# EAGLE design sensorCO2 (EAGLE 6.6.0)
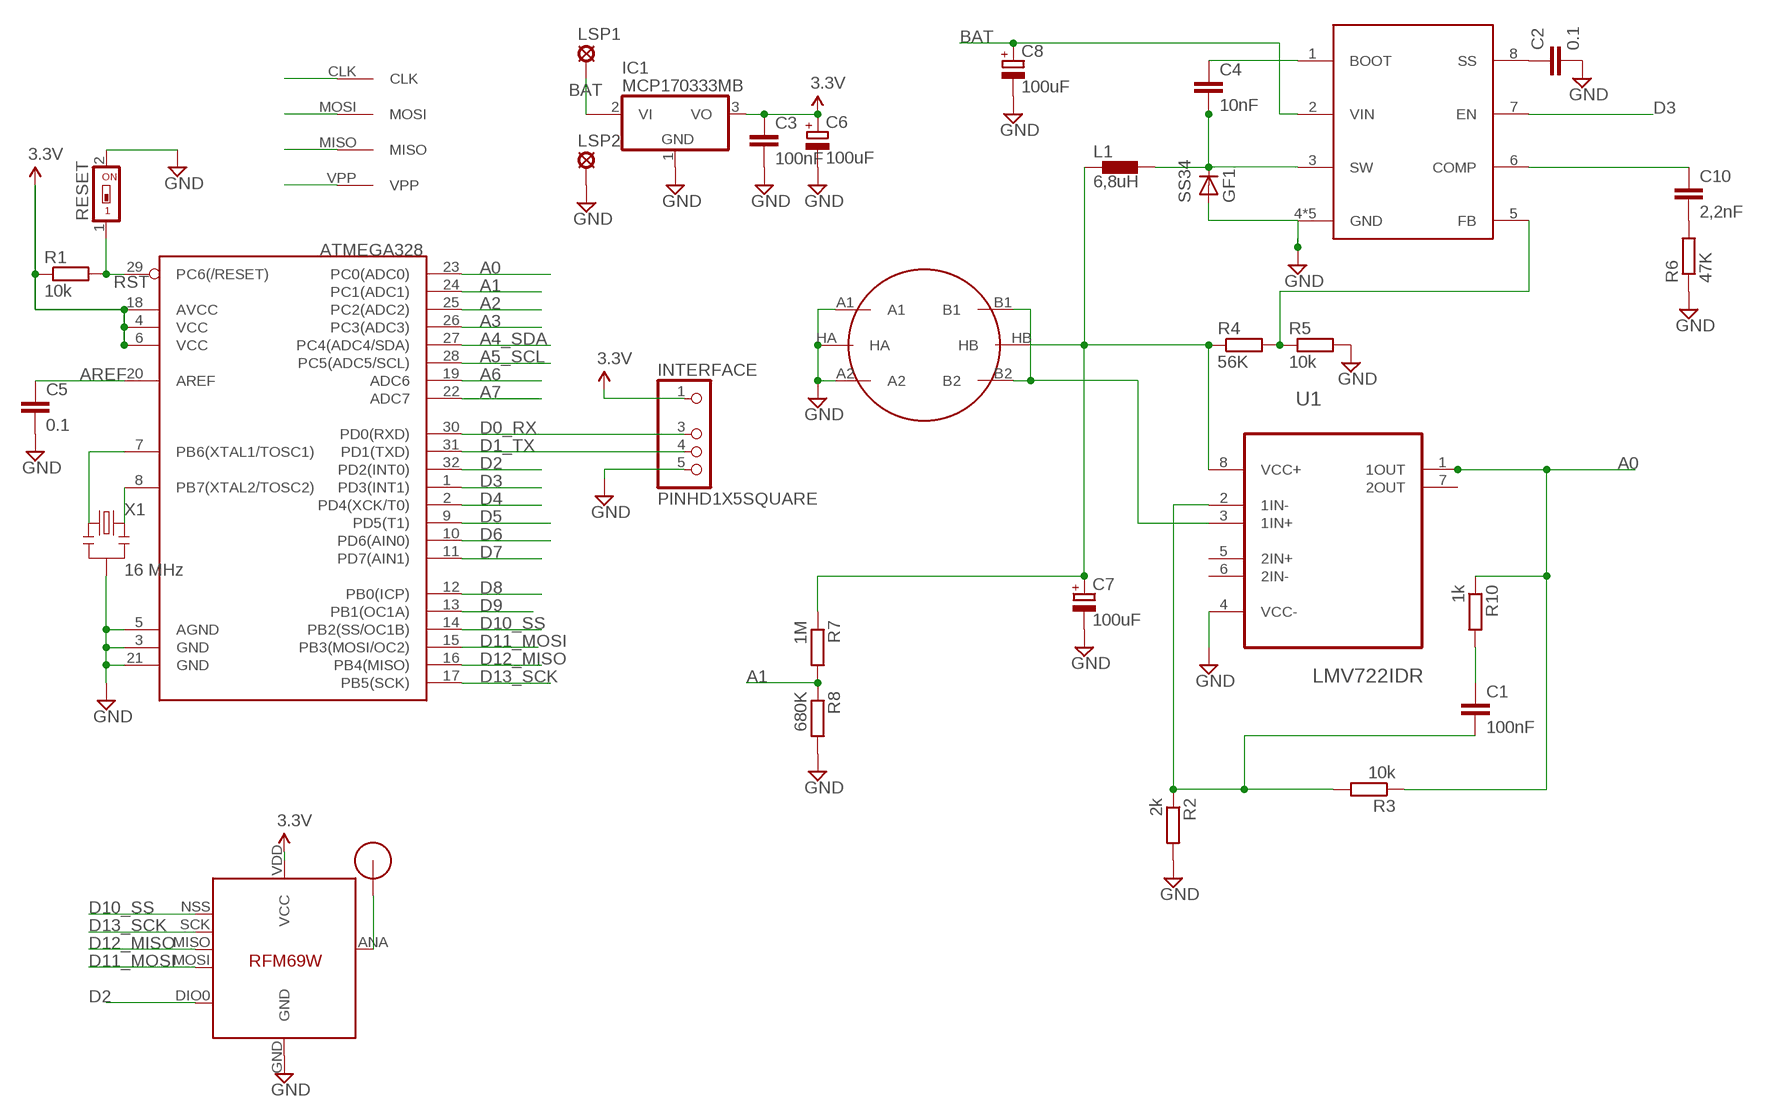
[diagram p0: schematic, sheet 1]

## Parts
ATMEGA328  ATMega-328  ATMEGA168/328TQFP32  [TQFP32-08]
C1  100nF  C-EUC2012  [C2012]
C2  0.1  C-EUC2012  [C2012]
C3  100nF  C-EUC2012  [C2012]
C4  10nF  C-EUC2012  [C2012]
C5  0.1  C-EUC2012  [C2012]
C6  100uF  CPOL-EUSMCB  [SMC_B]
C7  100uF  CPOL-EUSMCB  [SMC_B]
C8  100uF  CPOL-EUSMCB  [SMC_B]
C10  2,2nF  C-EUC2012  [C2012]
IC1  MCP170333MB  [SOT89]
IC4  RFM69  [RFM69W-MINPADS]
INTERFACE  PINHD1X5SQUARE  [PINHD1X05-SQUARE]
L1  6,8uH  DR1030  [DR1030]
LSP1  LSP11  [LSP11]
LSP2  LSP11  [LSP11]
R1  10k  R-EU_R2012  [R2012]
R2  2k  R-EU_R2012  [R2012]
R3  10k  R-EU_R2012  [R2012]
R4  56K  R-EU_R2012  [R2012]
R5  10k  R-EU_R2012  [R2012]
R6  47K  R-EU_R2012  [R2012]
R7  1M  R-EU_R2012  [R2012]
R8  680K  R-EU_R2012  [R2012]
R10  1k  R-EU_R2012  [R2012]
RESET  SWS001  [SMS-001]
SS34  GF1  [SMA-DO214AC]
U1  LMV722IDR  [SOIC127P600X175-8N]
U$1  RFM12B_ANTENNA  [RFM12B-ANTENNA]
U$2  AVRHEADERDIP  [AVRHEADER]
U$3  RT8272  [RT8272]
U$4  METHANE_SENSOR  [MQ-3]
X1  16 MHz  RESONATORSMD  [RESONATOR-SMD]

## Nets
6V: C7.+ L1.1 R4.1 R7.1 U1.8(VCC+) U$4.HB
A0: ATMEGA328.23(PC0(ADC0)) R3.1 R10.1 U1.1(1OUT)
A1: ATMEGA328.24(PC1(ADC1)) R7.2 R8.1
A2: ATMEGA328.25(PC2(ADC2))
A3: ATMEGA328.26(PC3(ADC3))
A4_SDA: ATMEGA328.27(PC4(ADC4/SDA))
A5_SCL: ATMEGA328.28(PC5(ADC5/SCL))
A6: ATMEGA328.19(ADC6)
A7: ATMEGA328.22(ADC7)
AREF: ATMEGA328.20(AREF) C5.1
BAT: C8.+ IC1.2@1(VI1) LSP1.MP U$3.2(VIN)
D0_RX: ATMEGA328.30(PD0(RXD)) INTERFACE.3
D1_TX: ATMEGA328.31(PD1(TXD)) INTERFACE.4
D2: ATMEGA328.32(PD2(INT0)) IC4.DIO0
D3: ATMEGA328.1(PD3(INT1)) U$3.7(EN)
D4: ATMEGA328.2(PD4(XCK/T0))
D5: ATMEGA328.9(PD5(T1))
D6: ATMEGA328.10(PD6(AIN0))
D7: ATMEGA328.11(PD7(AIN1))
D8: ATMEGA328.12(PB0(ICP))
D9: ATMEGA328.13(PB1(OC1A))
D10_SS: ATMEGA328.14(PB2(SS/OC1B)) IC4.NSS(SEL)
D11_MOSI: ATMEGA328.15(PB3(MOSI/OC2)) IC4.MOSI U$2.MOSI
D12_MISO: ATMEGA328.16(PB4(MISO)) IC4.MISO U$2.MISO
D13_SCK: ATMEGA328.17(PB5(SCK)) IC4.SCK U$2.CLK
GND: ATMEGA328.3(GND) ATMEGA328.5(AGND) ATMEGA328.21(GND) C2.2 C3.2 C5.2 C6.- C7.- C8.- IC1.1(GND) IC4.GND INTERFACE.5 LSP2.MP R2.2 R5.2 R6.1 R8.2 RESET.2 SS34.A U1.4(VCC-) U$3.4(GND) U$3.P$1(GND) U$3.P$2(GND) U$3.P$3(GND) U$3.P$4(GND) U$4.A1 U$4.A2 U$4.HA X1.2
N$1: ATMEGA328.7(PB6(XTAL1/TOSC1)) X1.1
N$2: R4.2 R5.1 U$3.5(FB)
N$3: IC4.ANA(ANT) U$1.P$1
N$4: C10.2 R6.2
N$5: C4.1 U$3.1(BOOT)
N$6: C1.1 R10.2
N$7: U1.3(1IN+) U$4.B1 U$4.B2
N$8: C4.2 L1.2 SS34.K(C) U$3.3(SW)
N$9: C2.1 U$3.8(SS)
N$11: C1.2 R2.1 R3.2 U1.2(1IN-)
N$12: C10.1 U$3.6(COMP)
N$21: ATMEGA328.8(PB7(XTAL2/TOSC2)) X1.3
RST: ATMEGA328.29(PC6(/RESET)) R1.2 RESET.1 U$2.VPP
VCC: ATMEGA328.4(VCC) ATMEGA328.6(VCC) ATMEGA328.18(AVCC) C3.1 C6.+ IC1.3(VO) IC4.VDD(VCC) INTERFACE.1 R1.1 ; supply symbol labelled 3.3V
Unconnected: IC1.2(VI) U1.5(2IN+) U1.6(2IN-) U1.7(2OUT)

## Library data of the parts
ATMEGA328 = LowPowerLab:ATMEGA168/328: Atmel 32-pin 8-bit micro, 16k flash.
C1-C5 C10 = resistor:C-EU: CAPACITOR, European symbol
C6-C8 = resistor:CPOL-EU: POLARIZED CAPACITOR, European symbol
IC1 = linear:MCP1703*: 250 mA, 16V, Low Quiescent Current LDO Regulator Source: http://ww1.microchip.com/downloads/en/DeviceDoc/22049b.pdf
IC4 = LowPowerLab:RFM69
INTERFACE = eagle-library-edeca.net-v5:PINHD1X5
L1 = inductors:DR1030: DR1030 Series Low Profile Power Inductors Source: Data sheet <http://www.cooperbussmann.com/pdf/c73e479f-f867-4c64-ae26-9c1f23814163.pdf>
LSP1 LSP2 = solpad:LSP11: SOLDER PAD drill 1.1 mm
R1-R8 R10 = resistor:R-EU_: RESISTOR, European symbol
RESET = smd-special:SWS001: SMD Dip Switch 1 pol.
SS34 = diode:GF1: DIODE
U1 = Texas Instruments_By_element14_Batch_1:LMV722IDR: OPERATIONAL AMPLIFIERS; MPN: LMV722IDR; OC_FARNELL: -; OC_NEWARK: 02M3640; PACKAGE: SOIC-8; SUPPLIER: Texas Instruments
U$1 = LowPowerLab:RFM12B_ANTENNA
U$2 = RemoteHome:AVRHEADER
U$3 = RemoteHome:RT8272
U$4 = SparkFun-Sensors:METHANE_SENSOR: MQ-4 Methane Gas Sensor SEN-09404
X1 = SparkFun:RESONATOR: Resonator Small SMD resonator. This is the itty bitty 10/20MHz resonators with built in caps. CSTCE10M0G55 and CSTCE20M0V53. Footprint has been reviewed closely but hasn't been tested yet.

## Net classes
1 power: width 0.381 mm, clearance 0.254 mm

## Board
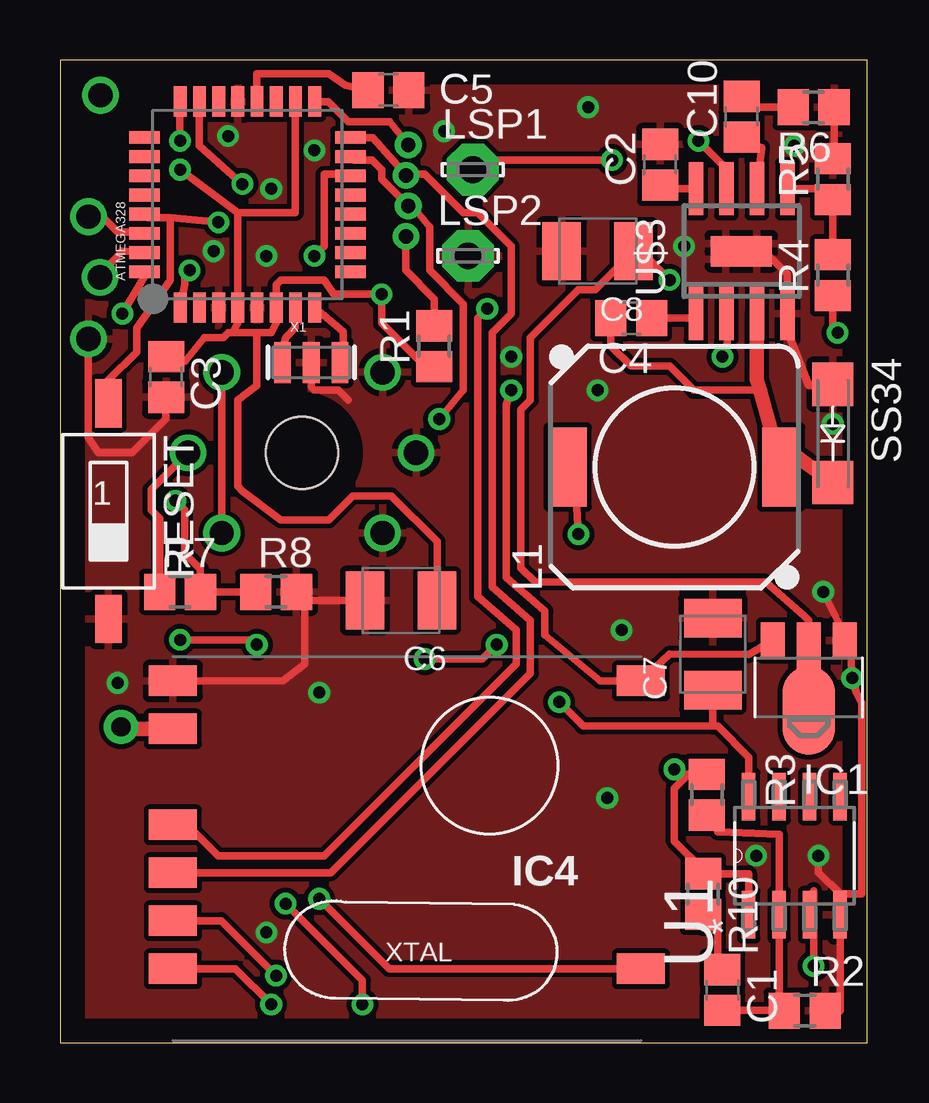
[diagram p1: board, top side]
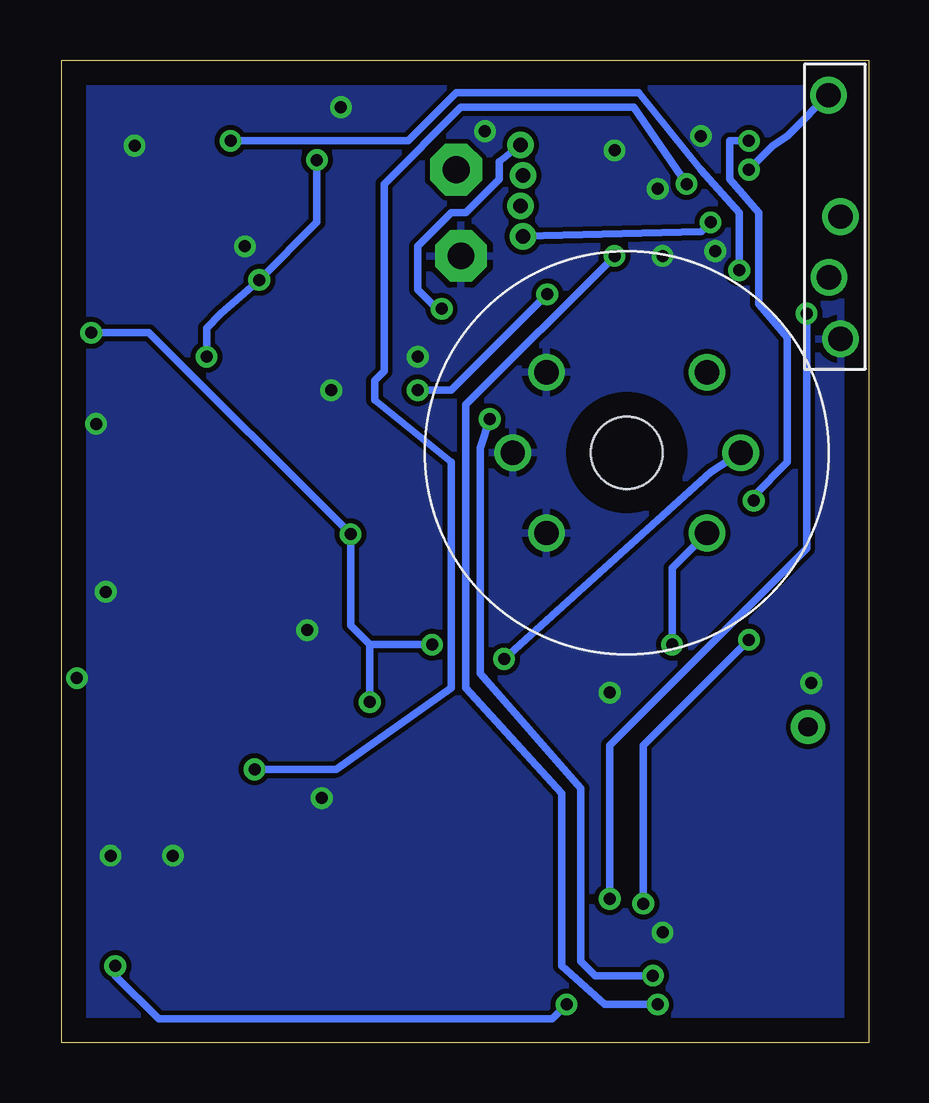
[diagram p2: board, bottom side, seen from below]

Size 33.63 x 40.97 mm. Coordinates in mm from the lower left corner, seen from the top.
Outline: 0,0 33.63,0 33.63,40.97 0,40.97 0,0
Copper layers (1*16): Top 0.035mm / dielectric 1.5mm / Bottom 0.035mm
Design rules "default": minimum track width 10mil, minimum drill 24mil, track to track 8mil, track to pad 8mil, pad to pad 8mil, via to via 8mil, smd to smd 8mil, copper to edge 40mil, drill to drill 8mil, minimum pad ring 10mil, minimum via ring 8mil, stop-mask expansion 4mil, vias tented up to drill 0mil, thermal gap 10mil

### Footprints (pad centres in the part's own frame; a part is rotated, then mirrored left to right if it is on the bottom)
TQFP32-08 = smd 1.27 x 0.533: 1 -4.293,2.8; 2 -4.293,2; 3 -4.293,1.2; 4 -4.293,0.4; 5 -4.293,-0.4; 6 -4.293,-1.2; 7 -4.293,-2; 8 -4.293,-2.8; 17 4.293,-2.8; 18 4.293,-2; 19 4.293,-1.2; 20 4.293,-0.4; 21 4.293,0.4; 22 4.293,1.2; 23 4.293,2; 24 4.293,2.8 | smd 0.533 x 1.27: 9 -2.8,-4.293; 10 -2,-4.293; 11 -1.2,-4.293; 12 -0.4,-4.293; 13 0.4,-4.293; 14 1.2,-4.293; 15 2,-4.293; 16 2.8,-4.293; 25 2.8,4.293; 26 2,4.293; 27 1.2,4.293; 28 0.4,4.293; 29 -0.4,4.293; 30 -1.2,4.293; 31 -2,4.293; 32 -2.8,4.293
C2012 = smd 1.3 x 1.5: 1 -0.85,0; 2 0.85,0
SMC_B = smd 1.6 x 2.4: + -1.5,0; - 1.5,0
SOT89 = smd 1 x 1.5: 1 -1.499,-1.981; 3 1.499,-1.981 | smd 1 x 2: 2 0,-1.727 | smd 2.2 x 3.7: 2@1 0,0.94
RFM69W-MINPADS = smd 2 x 1.27: ANA 8,-5; DIO0 -11.5,5; GND 8,-7; MISO 8,1; MOSI 8,3; NSS 8,5; SCK 8,-1; VDD -11.5,-7
PINHD1X05-SQUARE = drill 1.016: 1 -5.061,-0.269; 3 0,0.24; 4 2.54,-0.24; 5 5.099,0.24
DR1030 = smd 3.3 x 1.6: 1 0,4.45; 2 0,-4.45
LSP11 = drill 1.118 pad 2.159 octagon: MP 0,0
R2012 = smd 1.3 x 1.5: 1 -0.85,0; 2 0.85,0
SMS-001 = smd 1.092 x 2.007: 1 0,-4.496; 2 0,4.496
SMA-DO214AC = smd 1.8 x 1.7: A -2.05,0; K 2.05,0
SOIC127P600X175-8N = smd 1.981 x 0.559: 1 -2.464,1.905; 2 -2.464,0.635; 3 -2.464,-0.635; 4 -2.464,-1.905; 5 2.464,-1.905; 6 2.464,-0.635; 7 2.464,0.635; 8 2.464,1.905
RFM12B-ANTENNA = drill 0.8 pad 1.422: P$1 0,0
AVRHEADER = drill 0.6 pad 0.813: CLK 2.54,0; MISO 1.27,0.091; MOSI 0,0; VPP -1.27,0.099
RT8272 = smd 0.6 x 2.2: 1 -1.905,-2.6; 2 -0.635,-2.6; 3 0.635,-2.6; 4 1.905,-2.6; 5 1.905,2.6; 6 0.635,2.6; 7 -0.635,2.6; 8 -1.905,2.6 | smd 1.27 x 0.635: P$1 -0.652,0.315; P$2 0.631,0.315; P$3 0.631,-0.322; P$4 -0.652,-0.322
MQ-3 = drill 1.016: A1 -3.35,3.35; A2 -3.35,-3.35; B1 3.35,3.35; B2 3.35,-3.35; HA -4.75,0; HB 4.75,0 | hole 3: 0,0
RESONATOR-SMD = smd 0.7 x 1.7: 1 -1.2,0; 2 0,0; 3 1.2,0

### Placement (x,y rotation side)
ATMEGA328  7.81,34.94 90 top
C1  27.6,2.2 270 top
C2  25,36.6 90 top
C3  4.42,27.76 270 top
C4  23.8,30.2 180 top
C5  13.68,39.72 0 top
C6  14.21,18.44 180 top
C7  27.2,16.2 90 top
C8  22.4,33 180 top
C10  28.4,38.6 90 top
IC1  31.2,14.8 180 top
IC4  12.7,8.09 180 top
INTERFACE  1.42,34.44 270 bottom
L1  25.6,24 90 top
LSP1  17.2,36.4 0 top
LSP2  17,32.8 0 top
R1  15.59,29.04 90 top
R2  31.03,1.34 0 top
R3  26.95,10.34 270 top
R4  32.2,32 90 top
R5  32.2,36 90 top
R6  31.4,39 180 top
R7  5,18.8 0 top
R8  9,18.8 0 top
R10  26.8,6.2 270 top
RESET  2.02,22.16 180 top
SS34  32.2,25.4 270 top
U1  30.6,7.8 90 top
U$1  2.54,13.17 0 top
U$2  14.51,34.89 90 top
U$3  28.4,33 0 top
U$4  10.09,24.6 0 bottom
X1  10.47,28.36 0 top

### Tracks (layer width: path | path; a pad name or v marks a point on that pad's centre or on a via)
6V  (via drill 0.5)
  Top 0.305: R7.1 4.15,21.85 3.8,22.2 3.8,23.06 U$4.HB | v15.2,16 17.6,16 v18.2,16.6 | v21.6,21.2 21.45,23.8 L1.1 | U1.8 28.7,11.9 27.4,13.2 27.2,13.2 | 27.2,13.2 21.8,13.2 v20.8,14.2 | R4.1 32.2,29.8 v32.4,29.6 | C7.+ 27.2,13.2
  Bottom 0.305: U$4.HB 6.6,23.8 v15.2,16 | v18.2,16.6 20.8,16.6 | 20.8,16.6 21.6,17.4 v21.6,21.2 30,29.6 v32.4,29.6 | v20.8,14.2 20.8,16.6
A0  (via drill 0.5)
  Top 0.305: U1.1 28.7,7.05 R10.1 26.8,7.2 25.6,8.4 25.6,10.6 26.2,11.2 R3.1 25.81,11.19 v25.6,11.4 | v7.6,35.8 5.8,37.4 ATMEGA328.23
  Bottom 0.305: v25.6,11.4 22.2,11.4 17.4,14.8 17.4,24.2 20.6,26.8 20.6,27.6 20.2,28 20.2,35.8 17,39 9.8,39 v7.6,35.8
A1  (via drill 0.5)
  Top 0.305: R8.1 R7.2 5.85,19.75 5.2,20.4 5.2,22.2 v4.8,22.6 | v5,37.6 4.98,39.2 ATMEGA328.24
  Bottom 0.305: v4.8,22.6 4.8,22.8 3.4,24.2 3.4,29.4 4.6,30.8 4.6,34.6 5.8,36 5.8,37.6 v5,37.6
AREF
  Top 0.305: C5.1 11.88,39.92 11.2,40.4 8.2,40.4 8.2,39.24 ATMEGA328.20
BAT  (via drill 0.5)
  Top 0.305: U$3.2 27.8,29.96 27.8,29 v27.6,28.6 | v23,36.8 17.6,36.8 LSP1.MP | v25.4,31.8 24.2,33 C8.+ 22.3,31.4 21.6,31.4 19.6,29.4 19.6,26.8 19.2,26.4 19.2,19.8 19.8,19.2 29.4,19.2 31,17.8 31.2,17.6 IC1.2@1
  Bottom 0.305: v27.6,28.6 27.6,29.8 27,30.4 v25.4,31.8 23,34.2 v23,36.8
D0_RX
  Top 0.305: INTERFACE.3 1.56,34.64 2.4,33.8 3.46,33.8 ATMEGA328.30
D1_TX
  Top 0.305: INTERFACE.4 1.7,32.1 2.4,32.8 2.58,33 ATMEGA328.31
D2  (via drill 0.5)
  Top 0.305: IC4.DIO0 13.71,3.09 v10.8,6 | v2.6,30.4 3.6,32.06 ATMEGA328.32
  Bottom 0.305: v10.8,6 10.8,12.4 2.6,20.6 v2.6,30.4
D3  (via drill 0.5)
  Top 0.305: U$3.7 27.77,36.44 v26.6,37.6 | v5.4,32.2 5.2,32 5.2,31.6 ATMEGA328.1
  Bottom 0.305: v26.6,37.6 19.2,37.6 17.2,39.6 9.6,39.6 7,36.4 5.4,34.6 v5.4,32.2
D10_SS  (via drill 0.5)
  Top 0.305: IC4.NSS 7.31,3.09 v8.8,1.6 | v10.6,32.8 11,33.2 11,36.2 12.04,36.2 ATMEGA328.14
  Bottom 0.305: v8.8,1.6 11,1.6 12.8,3.2 12.8,10.4 16.8,14.8 16.8,26.6 v10.6,32.8
D11_MOSI  (via drill 0.5)
  Top 0.305: ATMEGA328.15 12.24,36.8 13,36.8 13.4,36.4 13.4,36 U$2.MOSI 14.6,35 15.4,34 15.4,32.2 16.8,30.8 16.8,27.2 v15.8,26 | IC4.MOSI 6.71,5.09 v9,2.8
  Bottom 0.305: v9,2.8 11.4,2.8 12,3.4 12,10.6 16.2,15.4 16.2,24.8 v15.8,26
D12_MISO
  Top 0.305: ATMEGA328.16 13.04,37.74 U$2.MISO 14.58,36.2 15.2,36.2 16.8,34.6 17.4,34.6 18.8,33.2 18.8,30.4 18,29.6 18,19 19.6,17.6 19.6,15.4 11.29,7.09 IC4.MISO
D13_SCK  (via drill 0.5)
  Top 0.305: ATMEGA328.17 11.17,39.23 12,38.4 13.74,38.4 U$2.CLK | IC4.SCK 5.31,9.09 6.6,7.8 11,7.8 19,15.8 19,17.2 17.4,18.6 17.4,30.2 v17.8,30.6
  Bottom 0.305: v17.8,30.6 18,30.6 18.8,31.4 18.8,33.2 17.4,34.6 16.8,34.6 15.4,36 15.4,36.74 U$2.CLK
GND  (via drill 0.5)
  Top 0.305: 32.51,6.2 33.4,6.2 33.4,14.17 33.17,14.6 v33,15.2 32.9,16.7 IC1.1 | 32.51,6.2 U1.4 32.51,1.34 R2.2 | IC4.GND 9.29,15.09 10.2,15.8 10.2,18.15 R8.2 10.21,18.44 C6.- | R6.1 32.25,36.9 R5.2 | SS34.A 32.15,27.4 31.2,27.4 30.3,29.7 U$3.4 30.3,32.04 U$3.P$2 | INTERFACE.5 1.18,25.22 1.6,24.6 3,24.6 4.4,26 4.4,26.89 C3.2 | X1.2 10.47,27.33 10.6,27.2 11.6,27.2 12,26.8 | v31.6,7.8 31.6,7.11 32.51,6.2 | v31.8,18.8 32.8,16.8
  other vias: 29,7.8 10.8,14.6 22.8,10.2 8.6,4.6 2.4,15 22,39 26,33.2 30.6,37.4 32.2,25.8 6.4,33 8.6,32.8 8.8,35.6 10.6,37.2 7,37.8 16,38 22.4,27.2 18.8,28.6 23.4,17.2
  pour Bottom: 0.2,40.8 33.4,40.8 33.4,0.2 0.2,0.2
  pour Top: 33.4,0.2 0.2,0.2 0.2,40.8 33.4,40.8
N$1
  Top 0.305: ATMEGA328.7 9.81,29.81 9.4,29.4 9.2,28.63 X1.1
N$2
  Top 0.305: R4.2 R5.1 31.55,35.6 U$3.5
N$3
  Top 0.61: IC4.ANA 2.62,13.09 U$1.P$1
N$4
  Top 0.305: R6.2 28.65,39 C10.2
N$5
  Top 0.305: C4.1 26.3,30.2 U$3.1
N$6
  Top 0.305: C1.1 27.4,3.05 27.4,4.8 26.8,4.8 R10.2
N$7  (via drill 0.5)
  Top 0.305: U1.3 31.4,6.34 v31.4,3.2 | v12.6,1.6 12.6,2.6 v9.4,5.8 | U$4.B1 U$4.B2 | v5,16.8 8,16.8 v8.2,16.6
  Bottom 0.305: v31.4,3.2 31.4,2.8 29.6,1 13.2,1 v12.6,1.6 | v9.4,5.8 9.4,12.4 v5,16.8 | v8.2,16.6 8.2,19.79 U$4.B2
N$8
  Top 0.305: 30.8,24.35 L1.2 | C4.2 22.95,29.05 23.8,28.2 25.4,28.2 26.4,27.2 29.13,27.2 29.17,27.16
  Top 0.61: L1.2 29.17,27.16 29.04,27.65 U$3.3 | SS34.K 30.8,24.35
N$9
  Top 0.305: U$3.8 24.85,35.6 C2.1
N$11
  Top 0.305: R3.2 27.4,9.49 27.4,8.8 29.96,8.69 U1.2 29.96,1.34 R2.1 C1.2
N$12
  Top 0.305: U$3.6 29.23,37.31 C10.1
N$21
  Top 0.305: X1.3 11.8,28.76 11.8,29.66 ATMEGA328.8
RST  (via drill 0.5)
  Top 0.305: v6.6,34.2 4.6,34.4 | 4.6,34.4 3.66,34.4 ATMEGA328.29 | RESET.1 2.02,27.62 3.2,28.8 3.2,29.8 4.6,31.8 4.6,34.4 | R1.2 15.59,31.01 14.4,32.2 14.4,33.21 U$2.VPP
  Bottom 0.305: U$2.VPP 6.98,33.82 v6.6,34.2
VCC  (via drill 0.5)
  Top 0.305: 24.6,15.49 IC4.VDD | C3.1 5.21,28.41 6,29.4 6.8,29.4 7,29.6 7.2,29.6 | 7.2,29.6 7.4,30 7.4,30.64 ATMEGA328.4 7.4,34.6 | 8.2,29.6 8.8,29.6 9.01,30.01 ATMEGA328.6 9,31.6 9.2,31.8 11,31.8 11.4,31.2 v13.4,31.2 13.4,30 15.21,28.19 R1.1 | 8.2,29.6 7.2,29.6 | ATMEGA328.18 9.81,34.61 7.4,34.6 | IC1.3 28.69,16.18 25.4,16.2 IC4.VDD | IC4.VDD 22.51,15.09 20.2,17 20.2,18 18.6,19.4 18.6,26.6 v18.8,27.2 | C6.+ 15.71,20.89 13.8,22.8 12.2,22.8 11.2,21.8 9.2,21.8 7.6,23 7.4,23.2 7.4,26.8 8.2,27.4 8.2,29.6 | v5,36.4 7.4,34.6
  Bottom 0.305: v18.8,27.2 17.4,27.2 v13.4,31.2 | INTERFACE.1 1.5,39.7 3.4,37.8 4,37.4 v5,36.4